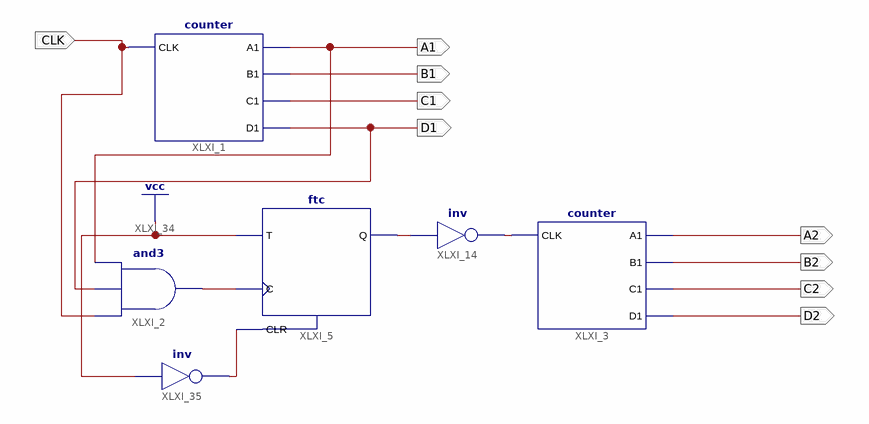
[diagram p0: schematic sheet 1]
// Xilinx ISE schematic counter0099.sch (spartan6) as structural Verilog: 6 symbols, 9 ports
module counter0099 (
  input  CLK,
  output A1,
  output B1,
  output C1,
  output D1,
  output A2,
  output B2,
  output C2,
  output D2
);

  wire XLXN_23, XLXN_30, XLXN_31, XLXN_80;

  counter XLXI_1 (.A1(A1), .B1(B1), .C1(C1), .CLK(CLK), .D1(D1));
  and XLXI_2 (XLXN_23, CLK, D1, A1);
  counter XLXI_3 (.A1(A2), .B1(B2), .C1(C2), .CLK(XLXN_31), .D1(D2));
  not XLXI_14 (XLXN_31, XLXN_30);
  ftc XLXI_5 (.C(XLXN_23), .CLR(XLXN_80), .T(1'b1), .Q(XLXN_30));
  not XLXI_35 (XLXN_80, 1'b1);
endmodule
